# EAGLE design MakeSpaceBadge-2 (EAGLE 7.4.0)
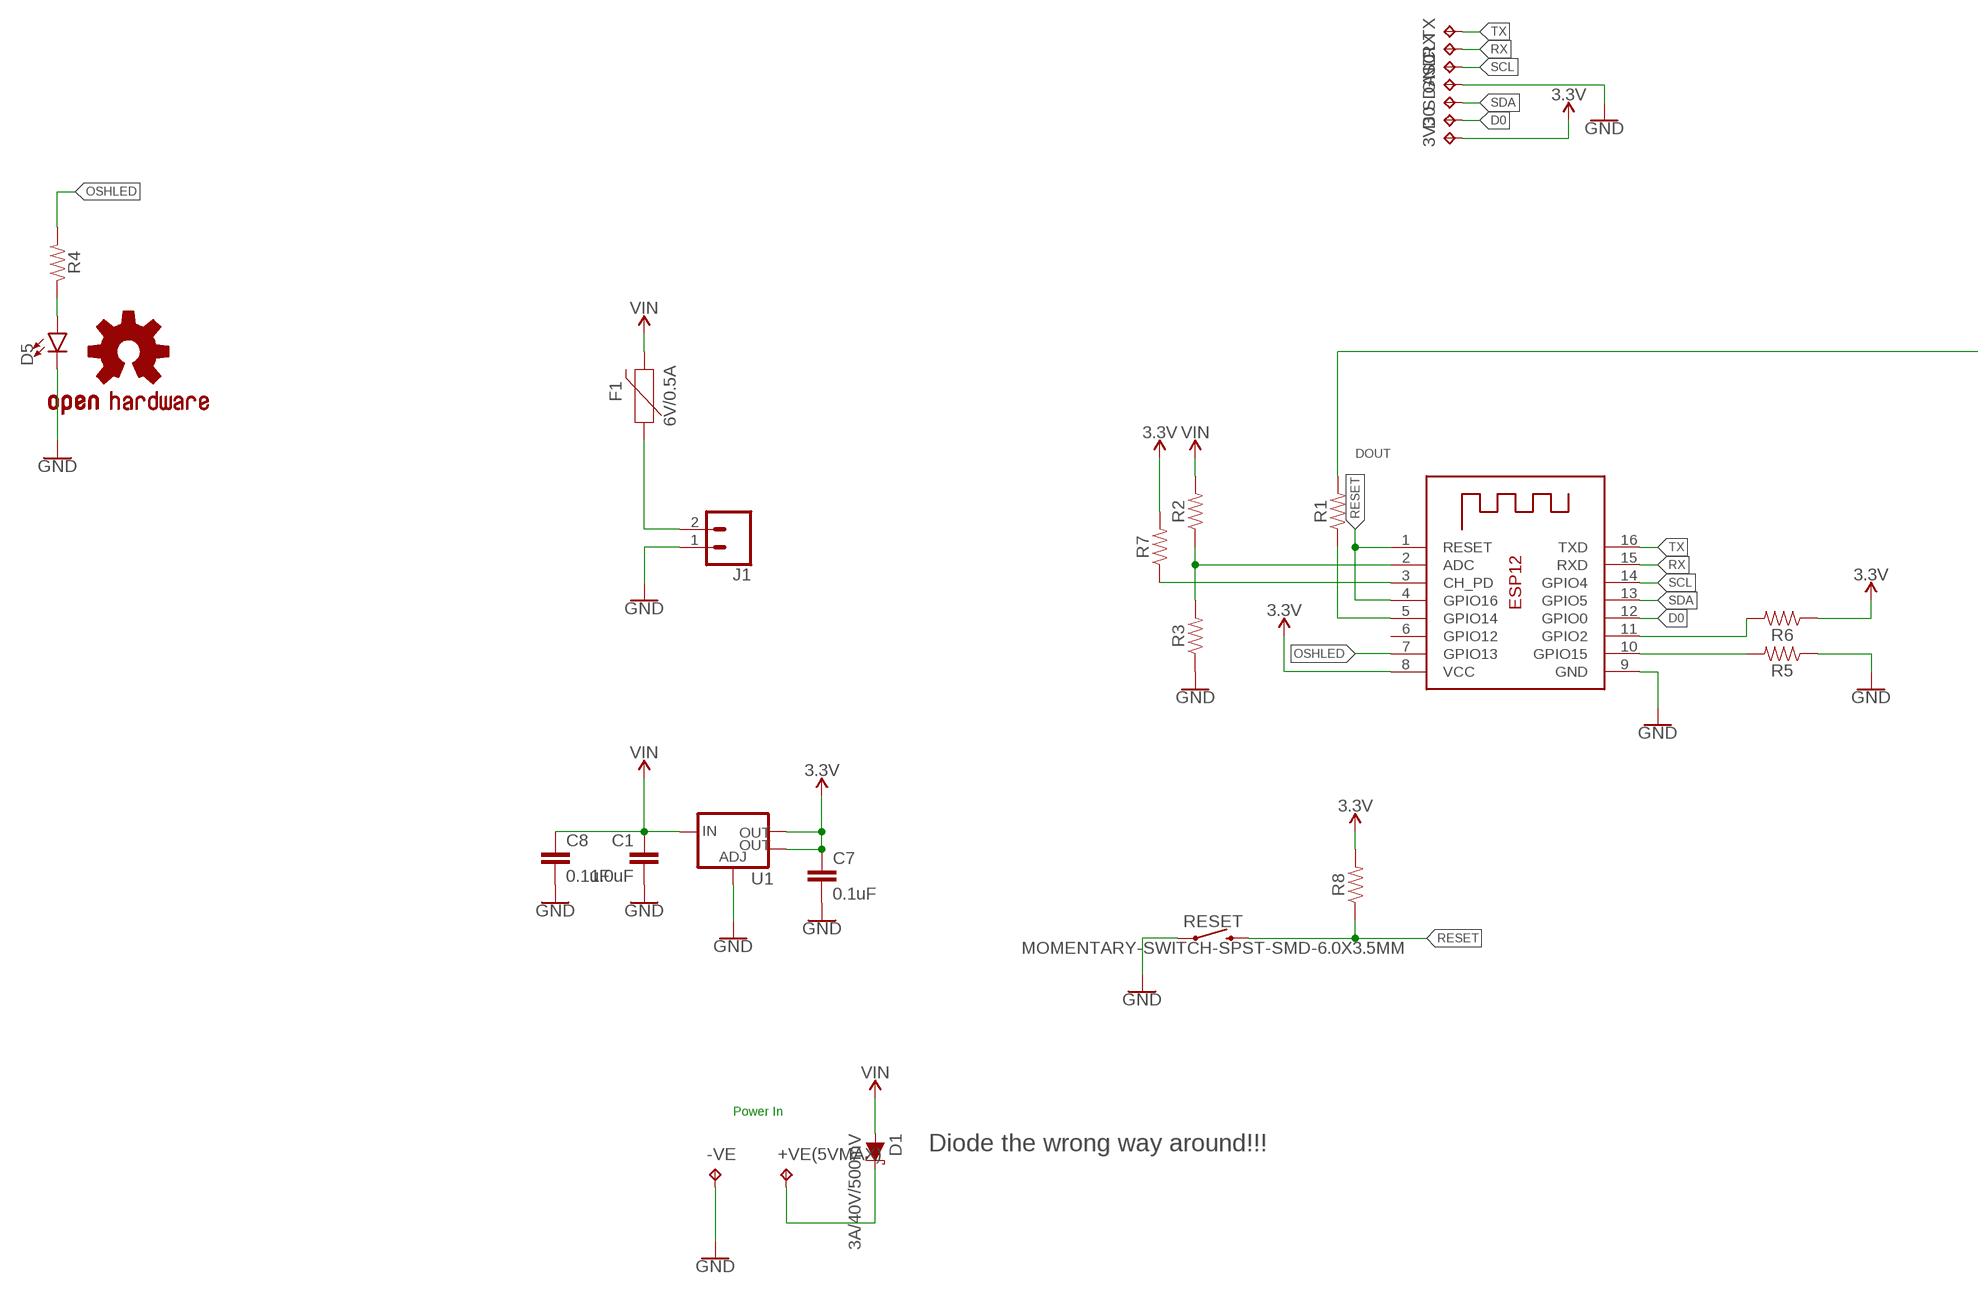
[diagram p0: schematic, sheet 1, part 1 of 2]
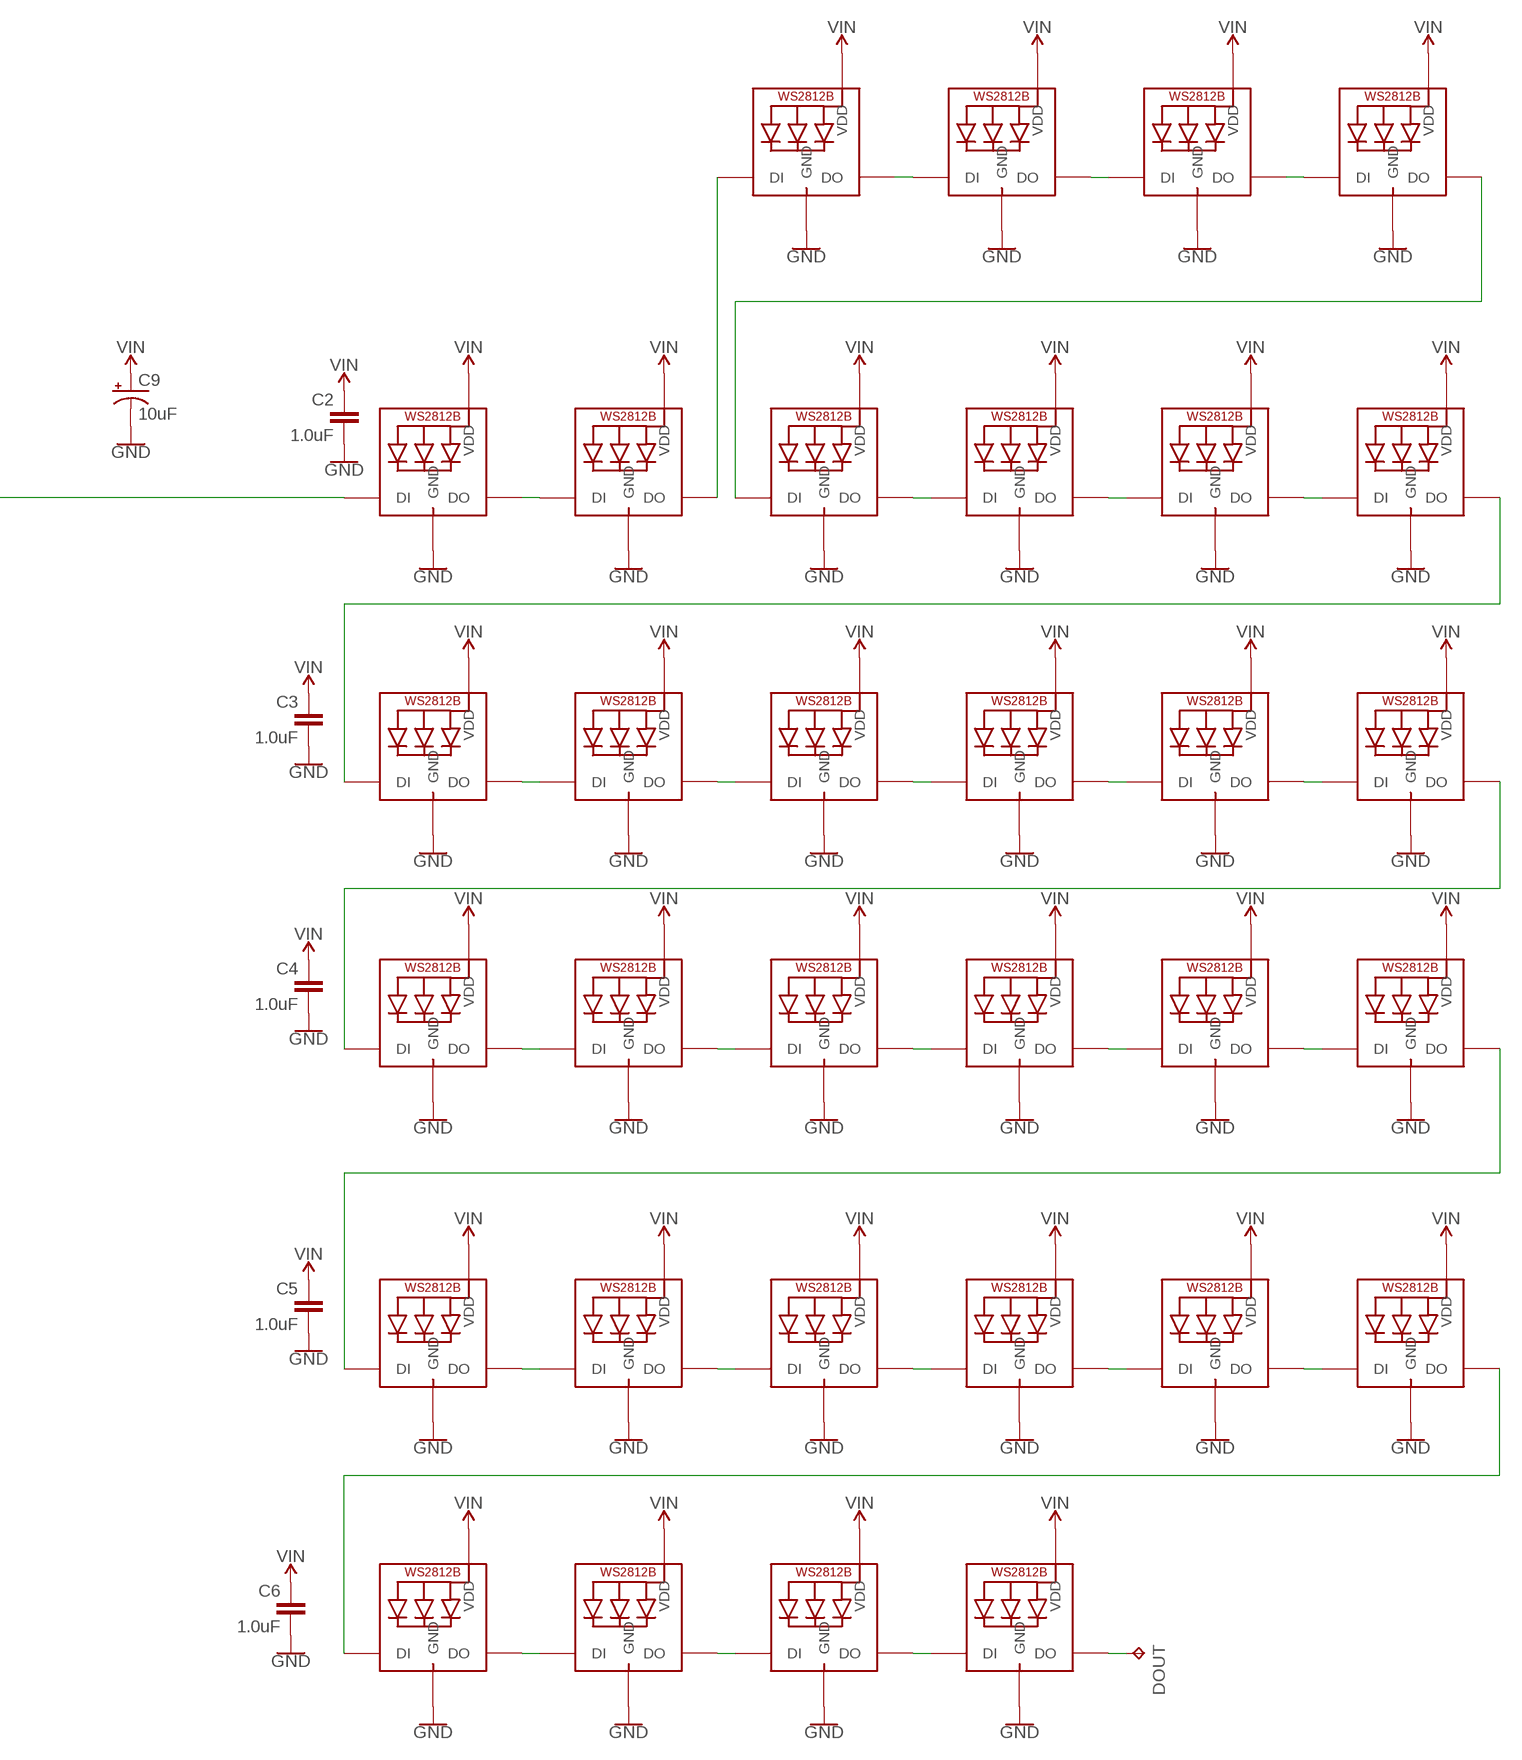
[diagram p1: schematic, sheet 1, part 2 of 2]

## Parts
3V3  TPTP20R  [TP20R]
+VE(5VMAX)  TPTP20SQ  [TP20SQ]
-VE  TPTP20SQ  [TP20SQ]
C1  1.0uF  1.0UF-0805-25V-10%  [0805]
C2  1.0uF  1.0UF-0805-25V-10%  [0805]
C3  1.0uF  1.0UF-0805-25V-10%  [0805]
C4  1.0uF  1.0UF-0805-25V-10%  [0805]
C5  1.0uF  1.0UF-0805-25V-10%  [0805]
C6  1.0uF  1.0UF-0805-25V-10%  [0805]
C7  0.1uF  1.0UF-0805-25V-10%  [0805]
C8  0.1uF  1.0UF-0805-25V-10%  [0805]
C9  10uF  10UF-POLAR-EIA3216-16V-10%(TANT)  [EIA3216]
D0  TPTP20R  [TP20R]
D1  3A/40V/500mV  DIODE-SCHOTTKY-B340A  [SMA-DIODE]
D5  LED1206-BOTTOM  [LED-1206-BOTTOM]
DOUT  TPTP20R  [TP20R]
F1  6V/0.5A  PPTC_HALF-AMP  [1206]
GND  TPTP20R  [TP20R]
J1  CONN_02-JST-2MM-SMT  [JST-2-SMD]
LED1  WS2812BBIGPADS  [WS2812B-BIGPADS]
LED2  WS2812B5050  [WS2812B]
LED3  WS2812BBIGPADS  [WS2812B-BIGPADS]
LED4  WS2812BBIGPADS  [WS2812B-BIGPADS]
LED5  WS2812BBIGPADS  [WS2812B-BIGPADS]
LED6  WS2812BBIGPADS  [WS2812B-BIGPADS]
LED7  WS2812BBIGPADS  [WS2812B-BIGPADS]
LED8  WS2812BBIGPADS  [WS2812B-BIGPADS]
LED9  WS2812BBIGPADS  [WS2812B-BIGPADS]
LED10  WS2812BBIGPADS  [WS2812B-BIGPADS]
LED11  WS2812BBIGPADS  [WS2812B-BIGPADS]
LED12  WS2812BBIGPADS  [WS2812B-BIGPADS]
LED13  WS2812BBIGPADS  [WS2812B-BIGPADS]
LED14  WS2812BBIGPADS  [WS2812B-BIGPADS]
LED15  WS2812BBIGPADS  [WS2812B-BIGPADS]
LED16  WS2812B5050  [WS2812B]
LED17  WS2812BBIGPADS  [WS2812B-BIGPADS]
LED18  WS2812BBIGPADS  [WS2812B-BIGPADS]
LED19  WS2812BBIGPADS  [WS2812B-BIGPADS]
LED20  WS2812BBIGPADS  [WS2812B-BIGPADS]
LED21  WS2812BBIGPADS  [WS2812B-BIGPADS]
LED22  WS2812BBIGPADS  [WS2812B-BIGPADS]
LED23  WS2812BBIGPADS  [WS2812B-BIGPADS]
LED24  WS2812BBIGPADS  [WS2812B-BIGPADS]
LED25  WS2812BBIGPADS  [WS2812B-BIGPADS]
LED26  WS2812BBIGPADS  [WS2812B-BIGPADS]
LED27  WS2812BBIGPADS  [WS2812B-BIGPADS]
LED28  WS2812BBIGPADS  [WS2812B-BIGPADS]
LED29  WS2812BBIGPADS  [WS2812B-BIGPADS]
LED30  WS2812BBIGPADS  [WS2812B-BIGPADS]
LED31  WS2812BBIGPADS  [WS2812B-BIGPADS]
LED32  WS2812BBIGPADS  [WS2812B-BIGPADS]
LOGO1  OSHW-LOGOL  [OSHW-LOGO-L]
R1  RESISTOR0805  [0805]
R2  RESISTOR0805  [0805]
R3  RESISTOR0805  [0805]
R4  RESISTOR0805  [0805]
R5  RESISTOR0805  [0805]
R6  RESISTOR0805  [0805]
R7  RESISTOR0805  [0805]
R8  RESISTOR0805  [0805]
RESET  MOMENTARY-SWITCH-SPST-SMD-6.0X3.5MM  [TACTILE_SWITCH_SMD_6.0X3.5MM]
RX  TPTP20R  [TP20R]
SCL  TPTP20R  [TP20R]
SDA  TPTP20R  [TP20R]
TX  TPTP20R  [TP20R]
U1  V_REG_LM1117SOT223  [SOT223]
X1  ESP-12  [ESP-12]

## Nets
3.3V: 3V3.TP C7.1 R6.1 R7.2 R8.2 U1.2(OUT) U1.4(OUT) X1.8(VCC)
D0: D0.TP X1.12(GPIO0)
DOUT: LED1.4-DIN(DI) R1.2
GND: -VE.TP C1.2 C2.2 C3.2 C4.2 C5.2 C6.2 C7.2 C8.2 C9.- D5.C GND.TP J1.1 LED1.3-GND(GND) LED2.3-GND(GND) LED3.3-GND(GND) LED4.3-GND(GND) LED5.3-GND(GND) LED6.3-GND(GND) LED7.3-GND(GND) LED8.3-GND(GND) LED9.3-GND(GND) LED10.3-GND(GND) LED11.3-GND(GND) LED12.3-GND(GND) LED13.3-GND(GND) LED14.3-GND(GND) LED15.3-GND(GND) LED16.3-GND(GND) LED17.3-GND(GND) LED18.3-GND(GND) LED19.3-GND(GND) LED20.3-GND(GND) LED21.3-GND(GND) LED22.3-GND(GND) LED23.3-GND(GND) LED24.3-GND(GND) LED25.3-GND(GND) LED26.3-GND(GND) LED27.3-GND(GND) LED28.3-GND(GND) LED29.3-GND(GND) LED30.3-GND(GND) LED31.3-GND(GND) LED32.3-GND(GND) R3.1 R5.1 RESET.1 U1.1(ADJ) X1.9(GND)
N$1: R1.1 X1.5(GPIO14)
N$2: LED2.2-DOUT(DO) LED24.4-DIN(DI)
N$3: LED1.2-DOUT(DO) LED2.4-DIN(DI)
N$4: LED3.2-DOUT(DO) LED4.4-DIN(DI)
N$5: LED4.2-DOUT(DO) LED5.4-DIN(DI)
N$6: LED5.2-DOUT(DO) LED6.4-DIN(DI)
N$7: LED6.2-DOUT(DO) LED7.4-DIN(DI)
N$8: LED7.2-DOUT(DO) LED8.4-DIN(DI)
N$9: LED8.2-DOUT(DO) LED9.4-DIN(DI)
N$10: LED9.2-DOUT(DO) LED10.4-DIN(DI)
N$11: LED10.2-DOUT(DO) LED11.4-DIN(DI)
N$12: LED11.2-DOUT(DO) LED12.4-DIN(DI)
N$13: LED12.2-DOUT(DO) LED13.4-DIN(DI)
N$14: LED13.2-DOUT(DO) LED14.4-DIN(DI)
N$15: LED14.2-DOUT(DO) LED15.4-DIN(DI)
N$16: LED15.2-DOUT(DO) LED16.4-DIN(DI)
N$17: LED16.2-DOUT(DO) LED17.4-DIN(DI)
N$18: LED17.2-DOUT(DO) LED18.4-DIN(DI)
N$19: LED18.2-DOUT(DO) LED19.4-DIN(DI)
N$20: LED19.2-DOUT(DO) LED20.4-DIN(DI)
N$21: LED20.2-DOUT(DO) LED21.4-DIN(DI)
N$22: LED3.4-DIN(DI) LED32.2-DOUT(DO)
N$23: LED23.4-DIN(DI) LED24.2-DOUT(DO)
N$24: LED22.4-DIN(DI) LED23.2-DOUT(DO)
N$25: R2.1 R3.2 X1.2(ADC)
N$26: D5.A R4.1
N$27: R5.2 X1.10(GPIO15)
N$28: F1.1 J1.2
N$29: R6.2 X1.11(GPIO2)
N$30: DOUT.TP LED31.2-DOUT(DO)
N$31: +VE(5VMAX).TP D1.C
N$32: R7.1 X1.3(CH_PD)
N$33: LED22.2-DOUT(DO) LED32.4-DIN(DI)
N$34: LED21.2-DOUT(DO) LED25.4-DIN(DI)
N$35: LED25.2-DOUT(DO) LED26.4-DIN(DI)
N$36: LED26.2-DOUT(DO) LED27.4-DIN(DI)
N$37: LED28.2-DOUT(DO) LED29.4-DIN(DI)
N$38: LED29.2-DOUT(DO) LED30.4-DIN(DI)
N$39: LED30.2-DOUT(DO) LED31.4-DIN(DI)
N$40: LED27.2-DOUT(DO) LED28.4-DIN(DI)
OSHLED: R4.2 X1.7(GPIO13)
RESET: R8.1 RESET.2 X1.1(RESET) X1.4(GPIO16)
RX: RX.TP X1.15(RXD)
SCL: SCL.TP X1.14(GPIO4)
SDA: SDA.TP X1.13(GPIO5)
TX: TX.TP X1.16(TXD)
VIN: C1.1 C2.1 C3.1 C4.1 C5.1 C6.1 C8.1 C9.+ D1.A F1.2 LED1.1-VDD(VDD) LED2.1-VDD(VDD) LED3.1-VDD(VDD) LED4.1-VDD(VDD) LED5.1-VDD(VDD) LED6.1-VDD(VDD) LED7.1-VDD(VDD) LED8.1-VDD(VDD) LED9.1-VDD(VDD) LED10.1-VDD(VDD) LED11.1-VDD(VDD) LED12.1-VDD(VDD) LED13.1-VDD(VDD) LED14.1-VDD(VDD) LED15.1-VDD(VDD) LED16.1-VDD(VDD) LED17.1-VDD(VDD) LED18.1-VDD(VDD) LED19.1-VDD(VDD) LED20.1-VDD(VDD) LED21.1-VDD(VDD) LED22.1-VDD(VDD) LED23.1-VDD(VDD) LED24.1-VDD(VDD) LED25.1-VDD(VDD) LED26.1-VDD(VDD) LED27.1-VDD(VDD) LED28.1-VDD(VDD) LED29.1-VDD(VDD) LED30.1-VDD(VDD) LED31.1-VDD(VDD) LED32.1-VDD(VDD) R2.2 U1.3(IN)
Unconnected: X1.6(GPIO12)

## Notes on the sheet
- Power In
- Diode the wrong way around!!!

## Library data of the parts
3V3 +VE(5VMAX) -VE D0 DOUT GND RX SCL SDA TX = testpad:TP: Test pad
C1-C6 = SparkFun-Capacitors:1.0UF: 1µF ceramic capacitors A capacitor is a passive two-terminal electrical component used to store electrical energy temporarily in an electric field.; PROD_ID: CAP-08064
C7 C8 = SparkFun-Capacitors:1.0UF: 1µF ceramic capacitors A capacitor is a passive two-terminal electrical component used to store electrical energy temporarily in an electric field.; PROD_ID: CAP-08064; VALUE: 1.0uF
C9 = SparkFun-Capacitors:10UF-POLAR: 10.0µF polarized capacitors A capacitor is a passive two-terminal electrical component used to store electrical energy temporarily in an electric field.; PROD_ID: CAP-00811
D1 = SparkFun-DiscreteSemi:DIODE-SCHOTTKY: Schottky diode A Schottky diode is a semiconductor diode which has a low forward voltage drop and a very fast switching action.; PROD_ID: DIO-09886
D5 = SparkFun-LED:LED: LED (Generic) Standard schematic elements and footprints for 5mm, 3mm, 1206, and 0603 sized LEDs. Generic LEDs with no color specified.
F1 = SparkFun-Fuses:PPTC: Resettable Fuse PPTC Resettable Fuse. Really a sort of resistor with a polymeric positive temperature coefficient whose resistance increases dramatically with an increase in temperature. When heated by the power passing through the resistance rises causing the current to be limited, protecting the circuit. This is achieved by the transition of the polymer from a crystalline to an amorphous state where the conductive carbon separates breaking the conductive pathways found in the cool crystalline structure. When a PPTC cools back down it resumes conducting letting the circuit turn back on. SparkFun Products: SparkFun RedBoard - Programmed with Arduino <https://www.sparkfun.com/products/12757> Pro Micro - 5V/16MHz <https://www.sparkfun.com/products/12640> Arduino Pro 328 - 5V/16MHz <https://www.sparkfun.com/products/10915> MP3 Trigger <https://www.sparkfun.com/products/13720>; PROD_ID: RES-08585
J1 = SparkFun-Connectors:CONN_02: Multi connection point. Often used as Generic Header-pin footprint for 0.1 inch spaced/style header connections On any of the 0.1 inch spaced packages, you can populate with these: Break Away Headers - Straight <https://www.sparkfun.com/products/116> (PRT-00116) Break Away Male Headers - Right Angle <https://www.sparkfun.com/products/553> (PRT-00553) Female Headers <https://www.sparkfun.com/products/115> (PRT-00115) Break Away Headers - Machine Pin <https://www.sparkfun.com/products/117> (PRT-00117) Break Away Female Headers - Swiss Machine Pin <https://www.sparkfun.com/products/743> (PRT-00743) For SCREWTERMINALS and SPRING TERMINALS visit here: Screw Terimnals on SparkFun.com <https://www.sparkfun.com/search/results?term=Screw+Terminals> (5mm/3.5mm/2.54mm spacing) This device is also useful as a general connection point to wire up your design to another part of your project. Our various solder wires solder well into these plated through hole pads. Hook-Up Wire - Assortment (Stranded, 22 AWG) <https://www.sparkfun.com/products/11375> (PRT-11375) Hook-Up Wire - Assortment (Solid Core, 22 AWG) <https://www.sparkfun.com/products/11367> (PRT-11367) View the entire wire category on our website here <https://www.sparkfun.com/categories/141> Special notes: Molex polarized connector foot print use with: PRT-08233 with associated crimp pins and housings. 2.54_SCREWTERM for use with PRT-10571. 3.5mm Screw Terminal footprints for PRT-08084 5mm Screw Terminal footprints for use with PRT-08432; PROD_ID: CONN-11443
LED1-LED32 = ThingySticks:WS2812B
LOGO1 = Tinamous:OSHW-LOGO: Open Source Hardware Logo This logo indicates the piece of hardware it is found on incorporates a OSHW license and/or adheres to the definition of open source hardware found here: http://freedomdefined.org/OSHW
R1-R8 = SparkFun-Resistors:RESISTOR: Generic Resistor Package
RESET = SparkFun-Switches:MOMENTARY-SWITCH-SPST: Momentary Switch (Pushbutton) - SPST Normally-open (NO) SPST momentary switches (buttons, pushbuttons). Variants PTH-12MM - 12mm square, through-hole Momentary Pushbutton Switch - 12mm Square <https://www.sparkfun.com/products/9190> (COM-09190) PTH-6.0MM, PTH-6.0MM-KIT - 6.0mm square, through-hole Mini Pushbutton Switch <https://www.sparkfun.com/products/97> (COM-00097) KIT package intended for soldering kit's - only one side of pads' copper is exposed. PTH-RIGHT-ANGLE-KIT - Right-angle, through-hole Right Angle Tactile Button <https://www.sparkfun.com/products/10791> - Used on SparkFun BigTime Watch Kit <https://www.sparkfun.com/products/11734> SMD-12MM - 12mm square, surface-mount Tactile Button - SMD (12mm) <https://www.sparkfun.com/products/12993> (COM-12993) Used on SparkFun PicoBoard <https://www.sparkfun.com/products/11888> SMD-4.5MM - 4.5mm Square Trackball Switch Used on SparkFun Blackberry Trackballer Breakout <https://www.sparkfun.com/products/13169> SMD-4.6MMX2.8MM - 4.60mm x 2.80mm, surface mount Used on SparkFun SAMD21 Mini Breakout <https://www.sparkfun.com/products/13664> SMD-5.2MM, SMD-5.2-REDUNDANT - 5.2mm square, surface-mount Mini Pushbutton Switch - SMD <https://www.sparkfun.com/products/8720> (COM-08720) Used on Arduino Pro Mini <https://www.sparkfun.com/products/11114> REDUNDANT package connects both switch circuits together SMD-6.0X3.5MM - 6.0 x 3.5mm, surface mount Momentary Reset Switch SMD <https://www.sparkfun.com/products/8229> (COM-08229) SMD-6.2MM-TALL - 6.2mm square, surface mount Tactile Button - SMD (6mm) <https://www.sparkfun.com/products/12992> Used on SparkFun Digital Sandbox <https://www.sparkfun.com/products/12651> SMD-RIGHT-ANGLE - Right-angle, surface mount Used on SparkFun Block for Intel® Edison - Arduino <https://www.sparkfun.com/products/13036>; PROD_ID: SWCH-00815; SF_SKU: COM-08229
U1 = SparkFun-IC-Power:V_REG_LM1117: Voltage Regulator LM1117 Standard adjustable voltage regulator but in SMD form. Spark Fun Electronics SKU : COM-00595; PROD_ID: VREG-08170
X1 = adafruit:ESP-12

## Board
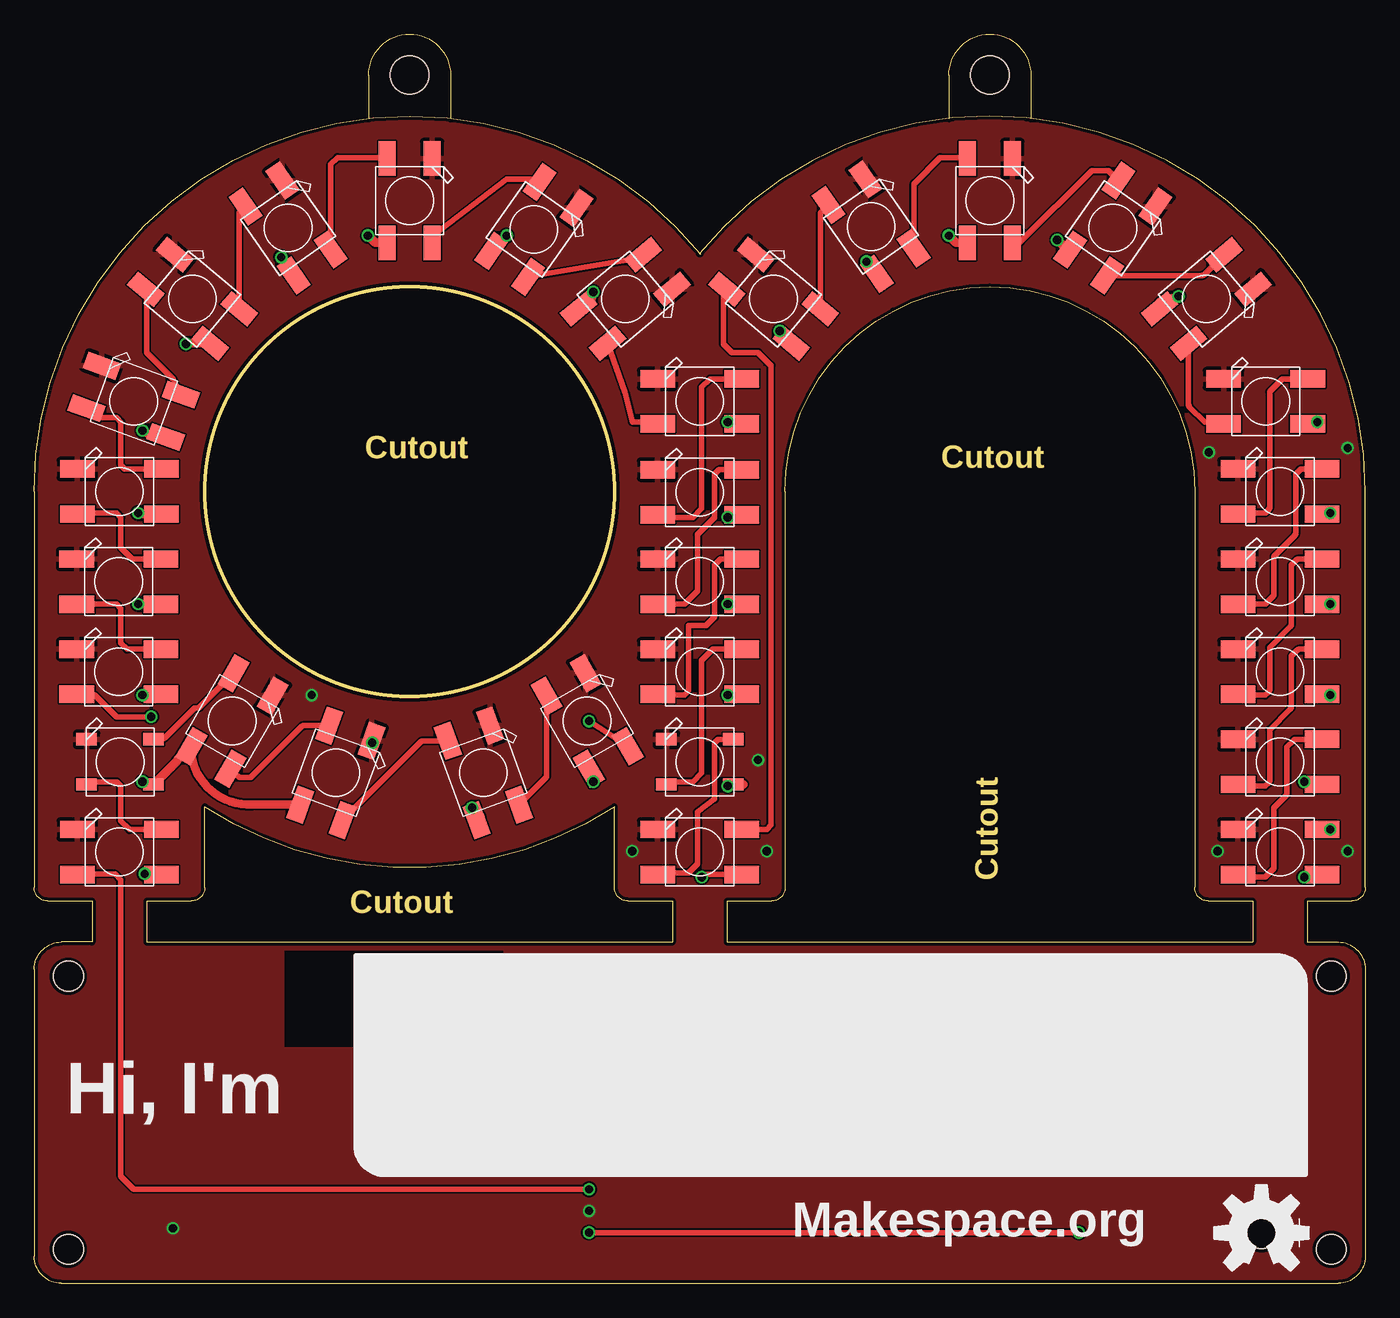
[diagram p2: board, top side]
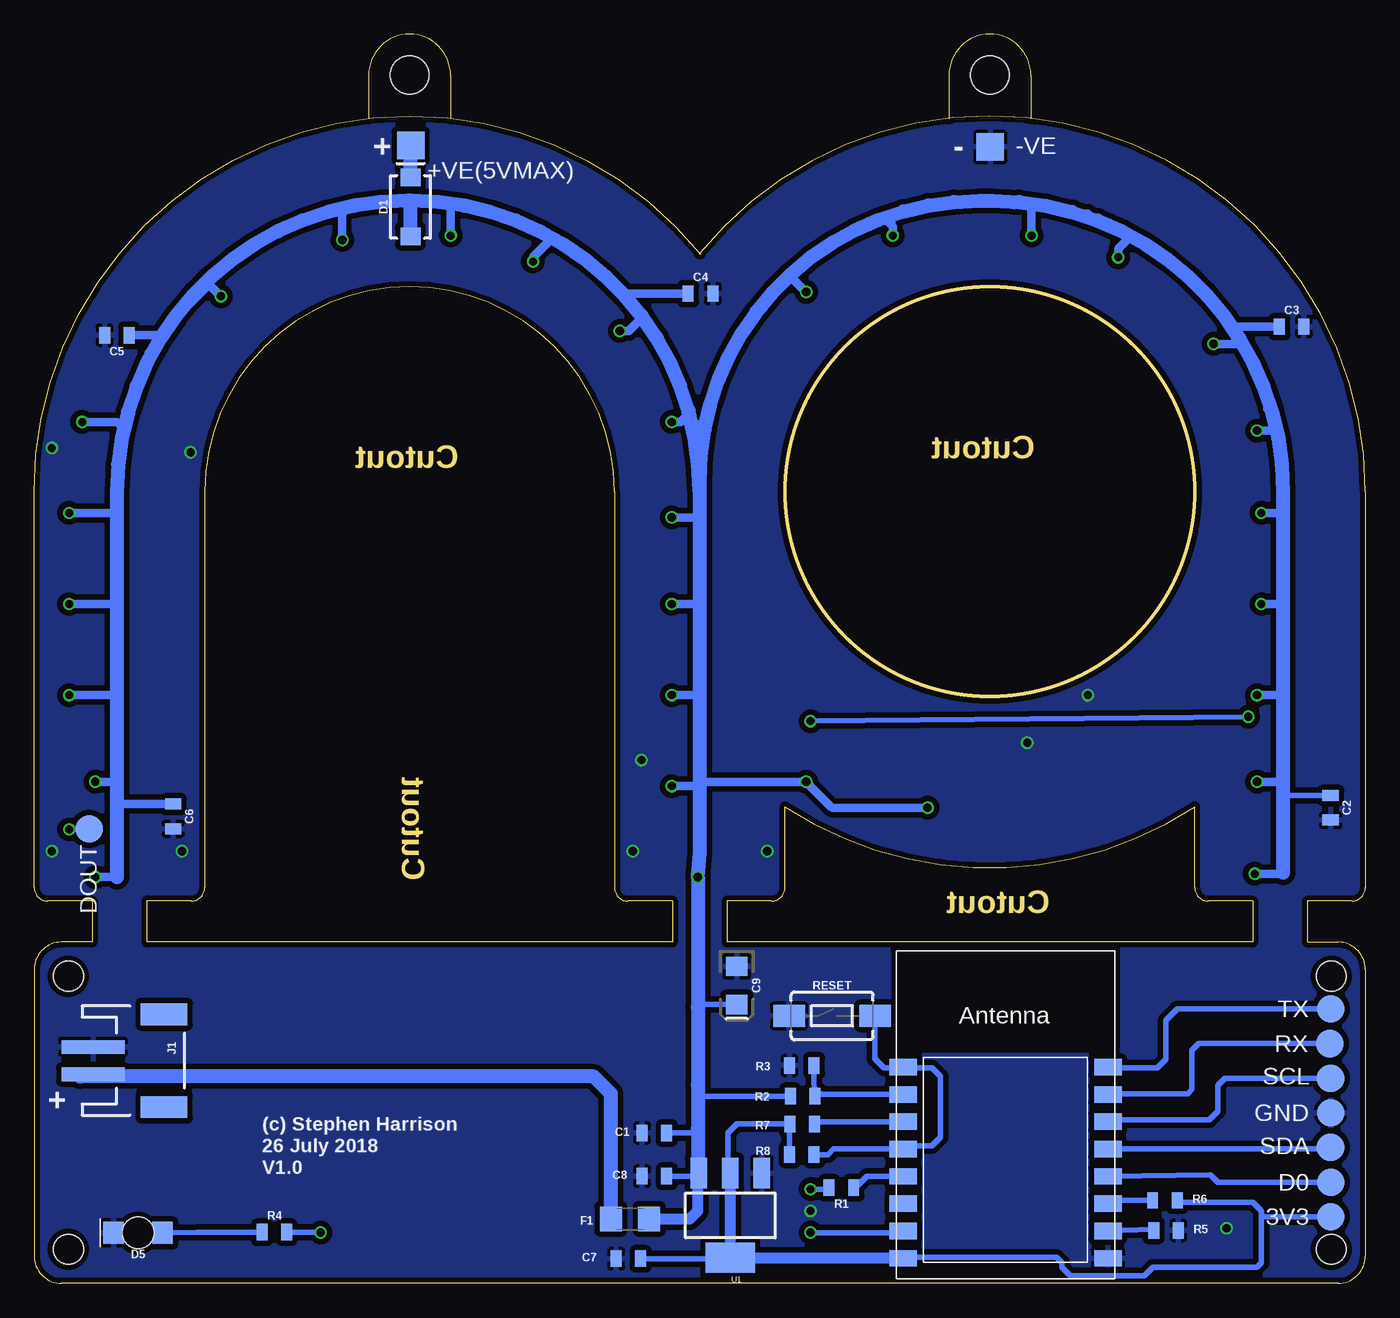
[diagram p3: board, bottom side, seen from below]

Size 97.5 x 91.5 mm. Coordinates in mm from the lower left corner, seen from the top.
Outline: 48.8,75.4 arc141 0,58 0,29 arc90 1,28 4.25,28 4.25,25
Outline: 48.7,75.4 arc-141 97.5,58 97.5,29 arc-90 96.5,28 93.25,28 93.25,25 95.5,25 arc-90 97.5,23 97.5,2 arc-90 95.5,0 2,0
Outline: 4.2,25 2,25 arc90 0,23 0,2
Outline: 2,0 arc-90 0,2
Outline: 2,0 arc-90 0,2
Outline: 30.5,85.3 30.5,88.5 arc180 24.5,88.5 24.5,85.3
Outline: 73,85.3 73,88.5 arc180 67,88.5 67,85.3
Outline: 8.25,28 11.5,28 arc90 12.5,29 12.5,34.9 arc66 42.5,34.9 42.5,29 arc90 43.5,28 46.75,28 46.75,25 8.25,25 8.25,28
Outline: 50.75,28 54,28 arc90 55,29 55,58 arc-180 85,58 85,29 arc90 86,28 89.25,28 89.25,25 50.75,25 50.75,28
Outline: circle at 27.5,58 radius 15
Copper layers (1*16): Top 0.035mm / dielectric 1.5mm / Bottom 0.035mm
Design rules "dirt_cheap_dirty_boards.v1": minimum track width 5mil, minimum drill 12mil, track to track 5mil, track to pad 5mil, pad to pad 5mil, via to via 5mil, smd to smd 0mil, copper to edge 10mil, drill to drill 10mil, minimum pad ring 10mil, minimum via ring 6mil, stop-mask expansion 2mil, vias tented up to drill 25mil, thermal gap 10mil
Holes 2.2 mm at 2.5,22.5 95,22.5 95,2.5 2.5,2.5
Holes 2.8 mm at 27.5,88.5 70,88.5

### Footprints (pad centres in the part's own frame; a part is rotated, then mirrored left to right if it is on the bottom)
TP20R = smd 2 x 2: TP 0,0
TP20SQ = smd 2 x 2: TP 0,0
0805 = smd 0.8 x 1.2: 1 -0.9,0; 2 0.9,0
EIA3216 = smd 1.4 x 1.6: + 1.4,0; - -1.4,0
SMA-DIODE = smd 1.27 x 1.47: A -2.15,0; C 2.15,0
LED-1206-BOTTOM = smd 1.5 x 1.6: A -1.8,0; C 1.8,0 | hole 2.3: 0,0
1206 = smd 1.6 x 1.8: 1 -1.4,0; 2 1.4,0
JST-2-SMD = smd 1 x 4.6: 1 -1,-3.7; 2 1,-3.7 | smd 1.6 x 3.4: NC1 -3.4,1.5; NC2 3.4,1.5
WS2812B-BIGPADS = smd 2.54 x 1.27: 1-VDD 3.085,-1.65; 2-DOUT 3.085,1.65; 3-GND -3.085,1.65; 4-DIN -3.085,-1.65
WS2812B = smd 1.5 x 0.9: 1-VDD 2.45,-1.65; 2-DOUT 2.45,1.65; 3-GND -2.45,1.65; 4-DIN -2.45,-1.65
TACTILE_SWITCH_SMD_6.0X3.5MM = smd 2.3 x 1.6: 1 -3.15,0; 2 3.15,0
SOT223 = smd 1.219 x 2.235: 1 -2.311,-3.099; 2 0,-3.099; 3 2.311,-3.099 | smd 3.6 x 2.2: 4 0,3.099
ESP-12 = smd 2 x 1.2: 1 -7.5,4.5; 2 -7.5,2.5; 3 -7.5,0.5; 4 -7.5,-1.5; 5 -7.5,-3.5; 6 -7.5,-5.5; 7 -7.5,-7.5; 8 -7.5,-9.5; 9 7.5,-9.5; 10 7.5,-7.5; 11 7.5,-5.5; 12 7.5,-3.5; 13 7.5,-1.5; 14 7.5,0.5; 15 7.5,2.5; 16 7.5,4.5

### Placement (x,y rotation side)
3V3  2.54,4.89 0 bottom
+VE(5VMAX)  69.92,83.34 0 bottom
-VE  27.47,83.24 0 bottom
C1  52.07,11.03 180 bottom
C2  2.54,34.84 270 bottom
C3  5.4,70.08 0 bottom
C4  48.7,72.5 0 bottom
C5  91.44,69.44 180 bottom
C6  87.31,34.2 270 bottom
C7  53.98,1.82 180 bottom
C8  52.07,7.85 180 bottom
C9  46.04,21.82 270 bottom
D0  2.54,7.41 0 bottom
D1  69.94,78.85 90 bottom
D5  89.89,3.7 180 bottom
DOUT  93.47,33.29 0 bottom
F1  53.86,4.73 0 bottom
GND  2.55,12.5 0 bottom
J1  89.48,16.32 270 bottom
LED1  6.25,31.6 0 top
LED2  6.3,38.2 0 top
LED3  6.2,44.8 0 top
LED4  6.2,51.4 0 top
LED5  6.25,58 0 top
LED6  7.3,64.6 340 top
LED7  11.6,72.1 320 top
LED8  18.6,77.3 305 top
LED9  27.5,79.3 270 top
LED10  36.6,77.2 235 top
LED11  43.3,72.1 220 top
LED12  48.75,64.6 0 top
LED13  48.75,57.95 0 top
LED14  48.75,51.4 0 top
LED15  48.75,44.8 0 top
LED16  48.75,38.2 0 top
LED17  48.75,31.6 0 top
LED18  54.15,72.1 320 top
LED19  61.3,77.4 305 top
LED20  70,79.3 270 top
LED21  79,77.3 235 top
LED22  32.9,37.4 290 top
LED23  22.1,37.4 250 top
LED24  14.5,41.2 240 top
LED25  85.85,72.1 220 top
LED26  90.2,64.6 0 top
LED27  91.25,58 0 top
LED28  91.25,51.4 0 top
LED29  91.25,44.8 0 top
LED30  91.25,38.2 0 top
LED31  91.25,31.6 0 top
LED32  40.5,41.2 300 top
LOGO1  89.89,3.7 0 top
R1  38.38,7.01 180 bottom
R2  41.22,13.71 180 bottom
R3  41.28,15.96 0 bottom
R4  79.91,3.76 0 bottom
R5  14.6,3.88 180 bottom
R6  14.68,6.09 180 bottom
R7  41.25,11.68 180 bottom
R8  41.27,9.44 180 bottom
RESET  39.05,19.6 0 bottom
RX  2.59,17.56 0 bottom
SCL  2.55,15.03 0 bottom
SDA  2.55,9.97 0 bottom
TX  2.54,20.11 0 bottom
U1  46.52,4.98 180 bottom
X1  26.35,11.34 0 bottom

### Tracks (layer width: path | path; a pad name or v marks a point on that pad's centre or on a via)
3.3V
  Bottom 0.305: 42.13,11.66 R7.2
  Bottom 0.406: 3V3.TP 7.41,4.89 arc45 7.59,4.96 7.62,4.99 | 7.62,4.99 7.62,5.2 arc-45 7.69,5.38 8.26,5.94 13.53,5.94 arc45 13.71,6.02 R6.1 | 7.62,4.99 7.62,1.5 7.94,1.18 15.56,1.18 16.19,0.55 21.59,0.55 22.23,1.18 22.23,1.5 22.62,1.9 33.66,1.9 X1.8 | U1.2 46.67,8.24 46.67,11.03 46.02,11.68 R7.2 42.17,11.66 R8.2 | C7.1 46.58,1.82 U1.4
  Bottom 0.813: X1.8 33.89,1.88 U1.4 U1.2
D0
  Bottom 0.406: X1.12 11.36,7.96 10.8,7.4 D0.TP
DOUT  (via drill 0.6)
  Top 0.406: LED1.4-DIN 3.9,29.95 4.18,29.98 5.94,29.98 6.35,29.57 6.35,7.85 7.3,6.9 v40.64,6.9
  Bottom 0.406: 40.11,6.9 v40.64,6.9 39.49,6.9 arc-45 39.31,6.97 R1.2
GND  (via drill 0.6)
  other vias: 96.2,31.66 86.68,31.66 96.2,61.19 86.04,60.87 53.66,31.66 43.81,31.66 53.02,38.33 10.16,4.04 40.64,5.31 20.32,43.09 24.77,39.6
  pour Bottom (isolate 0.406): 0,0 97.5,0 97.5,92 0,91.7
  pour Top: 0,-0.1 97.5,-0.2 97.5,91.9 0,91.6
N$1
  Bottom 0.406: R1.1 37.35,7.01 36.51,7.85 33.97,7.85 33.97,7.96 X1.5
N$2
  Top 0.406: LED2.2-DOUT arc45 8.87,39.9 9.4,39.9 arc45 9.58,39.98 11.75,42.14 11.95,42.14 arc45 12.13,42.21 LED24.4-DIN 14.39,44.92
N$3
  Top 0.406: LED1.2-DOUT 6.99,33.25 6.35,33.89 6.35,36.42 6.03,36.74 4.04,36.74 LED2.4-DIN
N$4
  Top 0.406: LED3.2-DOUT 6.8,46.45 6.35,46.9 6.35,49.44 6.03,49.76 LED4.4-DIN
N$5
  Top 0.406: LED4.2-DOUT 7.19,53.05 6.35,53.89 6.35,56.11 6.03,56.43 3.24,56.43 LED5.4-DIN
N$6
  Top 0.406: LED5.2-DOUT 6.62,59.65 6.35,59.92 6.35,63.09 6.03,63.41 4.68,63.41 LED6.4-DIN
N$7
  Top 0.406: LED6.2-DOUT 10.18,66.25 8.26,68.18 8.26,72.74 LED7.4-DIN
N$8
  Top 0.406: LED7.2-DOUT 15.02,78.43 LED8.4-DIN
N$9
  Top 0.406: LED8.2-DOUT 21.72,81.96 22.23,82.46 25.77,82.46 LED9.4-DIN
N$10
  Top 0.406: LED9.2-DOUT 29.15,76.69 34.61,80.88 36.82,80.88 LED10.4-DIN
N$11
  Top 0.406: LED10.2-DOUT 43.62,75 LED11.4-DIN
N$12
  Top 0.406: LED11.2-DOUT 43.27,65.23 43.81,63.09 45.52,63.09 LED12.4-DIN
N$13
  Top 0.406: LED12.2-DOUT 49.51,66.25 48.9,65.64 48.9,56.75 48.26,56.11 45.85,56.11 LED13.4-DIN
N$14
  Top 0.406: LED13.2-DOUT 50.16,59.6 49.85,59.28 49.85,56.11 48.58,54.84 48.58,50.71 47.62,49.76 45.67,49.76 LED14.4-DIN
N$15
  Top 0.406: LED14.2-DOUT 50.28,53.05 49.85,52.62 49.85,48.81 49.21,48.17 47.94,48.17 47.94,43.41 47.62,43.09 45.72,43.09 LED15.4-DIN
N$16
  Top 0.406: LED15.2-DOUT 49.71,46.45 48.9,45.63 48.9,37.38 48.26,36.74 46.49,36.74 LED16.4-DIN
N$17
  Top 0.406: LED16.2-DOUT 50.1,39.85 49.85,39.6 49.85,35.47 48.58,34.52 48.58,30.71 47.94,30.08 45.79,30.08 LED17.4-DIN
N$18
  Top 0.406: LED17.2-DOUT 53.66,33.25 53.98,33.57 53.98,67.22 53.02,68.18 51.12,68.18 50.48,68.81 50.48,72.57 LED18.4-DIN
N$19
  Top 0.406: LED18.2-DOUT 57.57,78.27 arc-45 57.65,78.45 LED19.4-DIN
N$20
  Top 0.406: LED19.2-DOUT 64.42,80.42 arc-45 64.5,80.6 66.36,82.46 68.17,82.46 arc-45 LED20.4-DIN
N$21
  Top 0.406: LED20.2-DOUT 72.07,76.22 arc45 72.25,76.29 77.47,81.51 78.58,81.51 arc-45 78.76,81.44 LED21.4-DIN
N$22  (via drill 0.6)
  Top 0.406: LED32.2-DOUT v40.64,41.19 | v8.57,41.5 6.03,41.5 4.45,43.09 LED3.4-DIN
  Bottom 0.406: v40.64,41.19 v8.57,41.5
N$23
  Top 0.406: LED23.4-DIN 19.78,40.86 arc45 19.6,40.79 15.88,37.06 15.13,37.06 arc-45 14.96,37.13 LED24.2-DOUT
N$24
  Top 0.406: LED22.4-DIN 28.5,39.73 arc45 28.32,39.66 LED23.2-DOUT
N$25
  Bottom 0.406: R3.2 40.38,14.72 R2.1 39.83,13.88 40.32,13.88 40.28,13.84 X1.2
N$26
  Bottom 0.406: R4.1 85.53,3.76 D5.A
N$27
  Bottom 0.406: X1.10 15.58,3.96 R5.2
N$28
  Bottom 1.016: F1.1 55.26,13.9 56.52,15.15 94.13,15.15 J1.2
N$29
  Bottom 0.406: R6.2 18.59,6.09 X1.11
N$30  (via drill 0.6)
  Top 0.406: v94.93,33.25 LED31.2-DOUT
  Bottom 0.406: DOUT.TP arc45 93.57,33.25 v94.93,33.25
N$31
  Bottom 1.016: D1.C +VE(5VMAX).TP
N$32
  Bottom 0.406: X1.3 39.87,11.84 40.32,11.66 40.34,11.66 R7.1
N$33
  Top 0.406: LED32.4-DIN 37.53,37.19 arc-45 37.45,37.01 LED22.2-DOUT
N$34
  Top 0.406: LED21.2-DOUT 85.53,73.83 arc45 85.71,73.9 LED25.4-DIN
N$35
  Top 0.406: LED25.2-DOUT 84.55,64.38 arc45 84.62,64.2 85.72,63.09 86.86,63.09 arc-45 87.04,63.02 LED26.4-DIN
N$36
  Top 0.406: LED26.2-DOUT 91.53,66.25 arc45 91.35,66.18 90.49,65.32 90.49,56.85 arc-45 90.41,56.67 90.17,56.43 88.35,56.43 arc45 LED27.4-DIN
N$37
  Top 0.406: LED28.2-DOUT 92.61,53.05 arc45 92.43,52.98 92.08,52.62 92.08,48.28 arc-45 92,48.1 90.49,46.58 90.49,43.52 arc-45 90.41,43.34 90.17,43.09 88.3,43.09 arc-45 LED29.4-DIN
N$38
  Top 0.406: LED29.2-DOUT 92.68,46.45 arc45 92.5,46.38 92.08,45.95 92.08,42.25 arc-45 92,42.07 90.49,40.55 90.49,36.85 arc-45 90.41,36.67 90.17,36.42 88.39,36.42 arc-45 88.22,36.5 LED30.4-DIN
N$39
  Top 0.406: LED30.2-DOUT 92.43,39.85 arc45 92.25,39.78 91.76,39.28 91.76,35.89 arc-45 91.68,35.72 90.81,34.84 90.81,30.5 arc-45 90.73,30.32 90.17,29.76 88.46,29.76 arc-45 88.28,29.83 LED31.4-DIN
N$40
  Top 0.406: LED27.2-DOUT 92.86,59.65 arc45 92.68,59.58 92.39,59.28 92.39,54.94 arc-45 92.32,54.77 90.81,53.25 90.81,50.5 arc-45 90.73,50.32 90.17,49.76 88.19,49.76 arc45 LED28.4-DIN
OSHLED  (via drill 0.6)
  Top 0.406: v76.52,3.72 v40.64,3.72
  Bottom 0.406: R4.2 76.55,3.76 v76.52,3.72 | v40.64,3.72 33.97,3.72 X1.7
RESET
  Bottom 0.406: RESET.2 35.9,16.45 35.24,15.79 33.91,15.79 | 33.91,15.79 X1.1 | 33.91,15.79 31.75,15.79 31.11,15.15 31.11,10.71 31.75,10.07 33.62,10.07 X1.4 38.97,9.84 39.37,9.44 R8.1
RX
  Bottom 0.406: RX.TP 12.19,17.56 12.7,17.06 12.7,14.2 13.02,13.88 18.81,13.88 X1.15
SCL
  Bottom 0.406: SCL.TP 10.29,15.03 10.79,14.52 10.79,12.61 11.43,11.98 18.72,11.98 X1.14
SDA
  Bottom 0.406: X1.13 2.68,9.84 SDA.TP
TX
  Bottom 0.406: TX.TP 13.77,20.11 14.61,19.28 14.61,16.42 15.24,15.79 18.8,15.79 X1.16
VIN  (via drill 0.6)
  Top 0.406: LED17.1-VDD 49.09,29.95 v48.9,29.76 | 39.88,71.54 40.07,71.54 arc90 40.32,71.79 40.32,71.99 40.7,71.99 arc90 40.96,72.24 v40.96,72.62
  Top 0.61: LED1.1-VDD 8.15,29.95 v8.1,30 | v7.94,36.74 8.13,36.55 LED2.1-VDD 10.44,38.24 arc45 10.48,38.33 11.43,39.28 | LED3.1-VDD 8,43.15 v7.94,43.09 | LED4.1-VDD v7.63,49.75 v7.62,49.76 | LED5.1-VDD 7.7,56.35 v7.62,56.43 | LED6.1-VDD 8.72,61.99 v7.94,62.46 | LED7.1-VDD 11.16,68.85 v11.11,68.81 | LED8.1-VDD 19.02,74.24 v18.1,75.16 | LED10.1-VDD | LED10.1-VDD v34.61,76.75 | LED11.1-VDD 39.88,71.54 40.32,71.99 v40.96,72.62 | LED16.1-VDD 51.95,36.55 v50.8,36.42 | LED15.1-VDD 50.86,43.15 v50.8,43.09 | LED14.1-VDD 51.13,49.75 v50.8,49.76 | LED13.1-VDD 50.99,56.3 v50.8,56.11 | LED12.1-VDD 50.95,62.95 v50.8,63.09 | LED18.1-VDD 55.45,68.92 v54.61,69.76 | LED19.1-VDD 61.72,74.09 v60.96,74.84 | LED20.1-VDD 67.53,76.22 v66.99,76.75 | LED21.1-VDD 75.64,75.72 v74.93,76.43 | LED25.1-VDD 82.43,71.86 v83.82,72.3 | LED26.1-VDD 93.83,62.95 v93.98,63.09 | LED27.1-VDD 94.86,56.35 v94.93,56.43 | LED28.1-VDD v94.92,49.75 v94.93,49.76 | LED29.1-VDD 94.88,43.15 v94.93,43.09 | LED30.1-VDD 93.22,36.55 v93.03,36.74 | LED31.1-VDD 93.22,29.95 v93.03,29.76 | LED9.1-VDD 24.98,76.22 v24.45,76.75 | LED32.1-VDD 40.61,37.09 v40.96,36.74 | LED22.1-VDD 32.41,33.86 32.7,33.57 32.7,34.1 arc45 32.63,34.28 v32.07,34.84 | LED24.1-VDD arc45 11.48,39.33 11.43,39.28 | LED23.1-VDD 15.96,35.06 arc-90 11.43,39.28
  Bottom 0.406: R2.2 48.75,13.71 48.9,14.52 | C1.1 49.21,11.03 48.9,11.34 | C8.1 49.05,7.85 U1.3 | C9.+ 48.71,20.42 48.9,20.23 | C2.1 5.66,35.74 arc-45 5.84,35.66 6.03,35.47 | 8.89,68.81 8.89,68.28 arc-45 8.82,68.1 8.26,67.54 8.26,67.01 arc-45 8.18,66.83 7.62,66.27 7.62,65.42 arc-45 7.55,65.24 7.3,65 7.3,64.15 arc-45 7.23,63.97 6.67,63.41 6.67,62.46 6.11,61.9 arc45 6.03,61.72 6.03,58.02 | v34.61,76.75 34.61,77.59 arc-45 34.68,77.77 34.92,78.02 | D1.A 69.94,78.95 arc-45 70.01,79.13 70.17,79.29 73.87,79.29 arc-45 74.05,79.21 74.61,78.65 | 69.85,79.29 67.42,79.29 arc45 67.24,79.21 66.99,78.97 64.88,78.97 arc45 64.7,78.9 64.14,78.34 63.29,78.34 arc45 63.11,78.26 62.87,78.02 62.02,78.02 arc45 61.84,77.94 60.96,77.06 60.43,77.06 arc45 60.25,76.99 59.69,76.43 59.45,76.19 arc-45 59.27,76.11 58.74,76.11 57.86,75.23 arc-45 57.68,75.16 57.15,75.16 54.29,72.3 54.17,72.42 arc45 53.99,72.5 53.66,72.5 53.66,71.29 arc-90 53.4,71.03 53.02,71.03 53.02,70.72 | 84.77,73.25 84.77,73.04 arc45 84.85,72.86 88.27,69.44 | 88.27,69.44 88.42,69.29 | C5.1 88.27,69.44 | 88.27,69.44 88.27,69.23 arc45 88.34,69.05 89.22,68.18 89.22,67.33 arc45 89.29,67.15 89.85,66.59 89.85,66.06 arc45 89.93,65.88 90.17,65.64 90.17,64.79 arc45 90.24,64.61 90.49,64.36 90.49,63.83 arc45 90.56,63.66 91.28,62.94 | 91.12,62.78 91.12,58.44 arc45 91.2,58.26 91.44,58.02 | 41.91,73.57 40.96,74.84 39.05,76.11 36.51,77.7 35.24,78.02 | 24.45,78.97 25.72,78.97
  Bottom 0.61: v8.1,30 6.11,30 6.03,30.08 | v7.94,36.74 6.03,36.74 | v7.94,43.09 6.03,43.09 | v7.62,49.76 6.03,49.76 | v7.62,56.43 6.03,56.43 | v7.94,62.46 6.67,62.46 | v11.11,68.81 9.53,68.81 | 9.53,68.81 8.89,68.81 | C3.1 9.53,70.08 9.53,68.81 | v18.1,75.16 18.1,75.79 17.3,76.59 | 17.3,76.59 17.14,76.75 | v34.61,76.75 34.61,77.38 35.24,78.02 34.92,78.02 34.29,78.34 32.7,78.65 32.38,78.97 30.8,78.97 30.48,79.29 28.26,79.29 | 27.3,79.29 26.04,79.29 25.72,78.97 | v40.96,72.62 41.91,73.57 42.23,73.89 | v50.8,36.42 48.75,36.42 48.43,36.74 v40.96,36.74 39.13,34.91 arc-45 38.95,34.84 v32.07,34.84 | v50.8,43.09 49.07,43.09 48.75,42.78 | v50.8,49.76 48.75,49.76 | v50.8,56.11 48.75,56.11 | v50.8,63.09 50.16,63.09 49.69,63.57 | 49.69,63.57 49.53,63.73 | 48.78,58.11 48.78,58.77 48.75,58.8 48.75,62.63 49.69,63.57 | v54.61,69.76 53.98,69.76 53.02,70.72 | C4.1 53.66,72.5 54.1,72.5 54.29,72.3 | v60.96,74.84 60.96,75.16 59.69,76.43 | v66.99,76.75 66.99,78.97 | v74.93,76.43 74.93,78.34 74.61,78.65 | v83.82,72.3 84.77,73.25 | C5.1 88.58,69.44 88.42,69.29 88.27,69.13 | v93.98,63.09 91.44,63.09 91.28,62.94 91.12,62.78 | v94.93,56.43 91.76,56.43 91.44,56.11 | v94.93,49.76 91.44,49.76 | v94.93,43.09 91.44,43.09 | v93.03,36.74 91.44,36.74 | C6.1 91.49,35.1 | 91.49,35.1 91.44,34.52 | v93.03,29.76 91.44,29.76 | 91.49,35.1 91.44,35.16 | v24.45,76.75 24.45,78.97 22.86,78.97 22.54,78.65 21.59,78.65 21.27,78.34 20.32,78.34 19.68,77.7 18.73,77.7 18.1,77.06 17.78,77.06 17.3,76.59
  Bottom 0.813: F1.2 49.48,4.73 48.9,5.31 48.9,7.19 U1.3
  Bottom 1.016: U1.3 48.9,8.78 48.9,11.34 48.9,14.52 48.9,20.23 v48.9,29.76 48.75,31.55 48.75,36.42 48.75,42.78 48.75,49.76 48.75,56.11 48.75,58.8 arc90 28.26,79.29 27.3,79.29 arc90 6.03,58.02 6.03,56.43 6.03,49.76 6.03,43.09 6.03,36.74 6.03,35.47 6.03,30.08 | 48.78,58.11 arc-90 69.85,79.29 | 69.85,79.29 70.17,79.29 arc-90 91.44,58.02 91.44,56.11 91.44,49.76 91.44,43.09 91.44,36.74 91.44,35.16 91.44,34.52 91.44,29.76 | D1.A 69.94,79.2 69.85,79.29

### Text on the board
Dimension: Cutout | Cutout | Cutout | Cutout
tNames: Hi, I'm | Makespace.org
bNames: - | + | + | (c) Stephen Harrison | 26 July 2018 | V1.0
Reference: 12 | 23 | 11 | 22 | 13 | 24 | 10 | 14 | 21 | 25 | 9 | 15 | 26 | 8 | 16 | 27 | 7 | 28 | 17 | 6 | 18 | 29 | 2 | 5 | 1 | 3 | 19 | 30 | 4 | 0 | 20 | 31